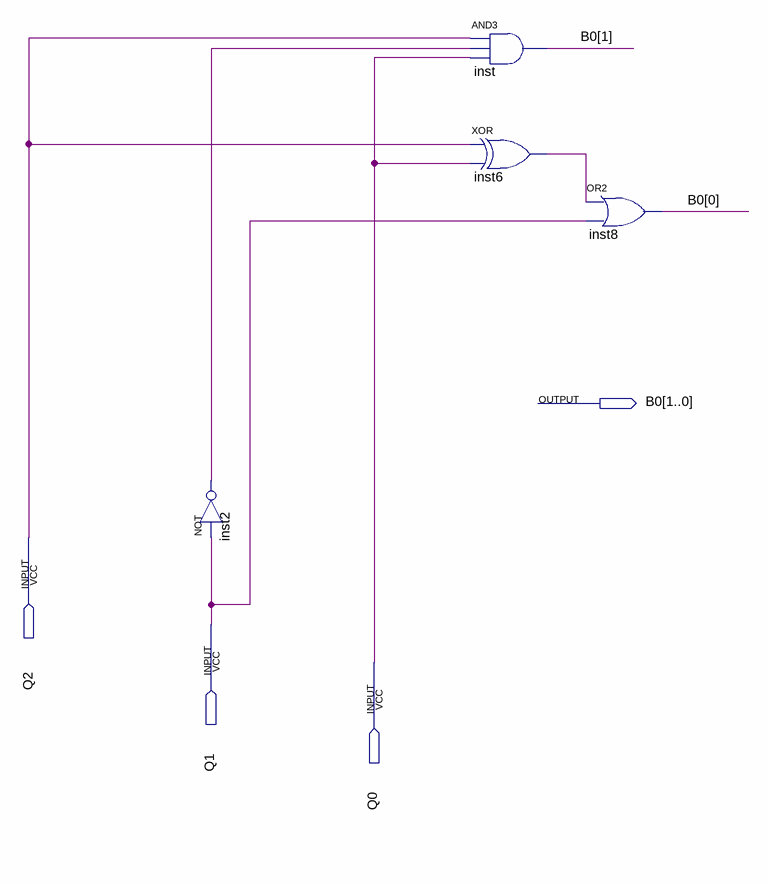
[diagram p0: schematic sheet]
// Quartus schematic B0_C3.bdf as structural Verilog: 4 symbols, 4 pins
module B0_C3 (
  input  Q2,
  input  Q1,
  input  Q0,
  output [1:0] B0
);

  wire inst2_out, inst6_out;

  not inst2 (inst2_out, Q1);
  and inst (B0[1], Q2, inst2_out, Q0);
  xor inst6 (inst6_out, Q2, Q0);
  or inst8 (B0[0], inst6_out, Q1);
endmodule
